# EAGLE design th (EAGLE 6.3)
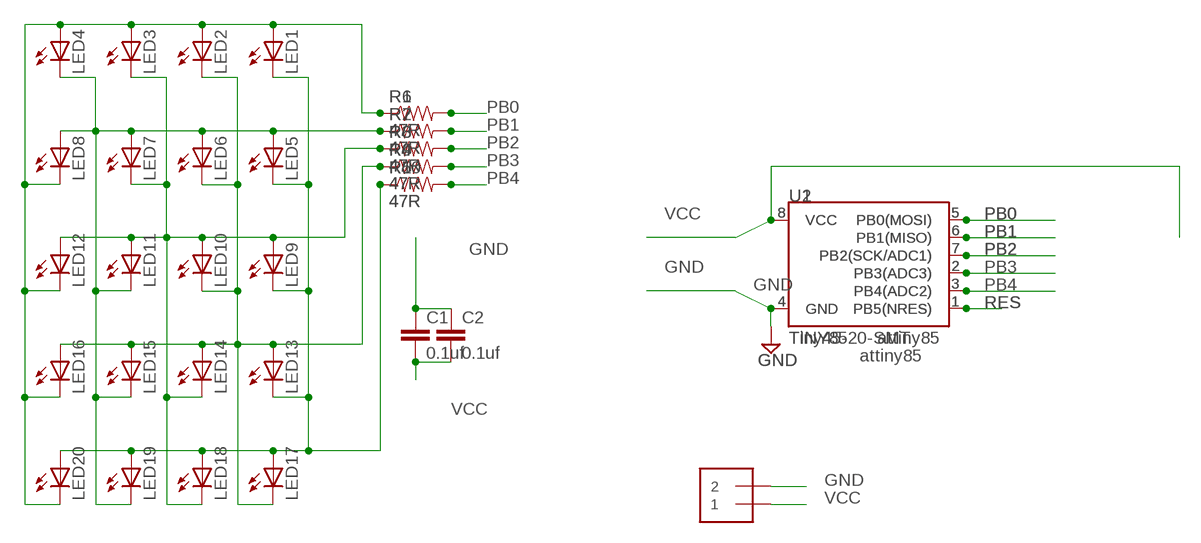
[diagram p0: schematic, sheet 1]

## Parts
C1  0.1uf  CAP0603-CAP  [0603-CAP]
C2  0.1uf  CAPKIT  [CAP-PTH-SMALL-KIT]
J1  1X2-3.5MM  [1X2-3.5MM]
LED1  LED3MM  [LED3MM]
LED2  LED3MM  [LED3MM]
LED3  LED3MM  [LED3MM]
LED4  LED3MM  [LED3MM]
LED5  LED3MM  [LED3MM]
LED6  LED3MM  [LED3MM]
LED7  LED3MM  [LED3MM]
LED8  LED3MM  [LED3MM]
LED9  LED3MM  [LED3MM]
LED10  LED3MM  [LED3MM]
LED11  LED3MM  [LED3MM]
LED12  LED3MM  [LED3MM]
LED13  LED3MM  [LED3MM]
LED14  LED3MM  [LED3MM]
LED15  LED3MM  [LED3MM]
LED16  LED3MM  [LED3MM]
LED17  LED3MM  [LED3MM]
LED18  LED3MM  [LED3MM]
LED19  LED3MM  [LED3MM]
LED20  LED3MM  [LED3MM]
R1  47R  RESISTORAXIAL-0.3  [AXIAL-0.3]
R2  47R  RESISTORAXIAL-0.3  [AXIAL-0.3]
R3  47R  RESISTORAXIAL-0.3  [AXIAL-0.3]
R4  47R  RESISTORAXIAL-0.3  [AXIAL-0.3]
R5  47R  RESISTORAXIAL-0.3  [AXIAL-0.3]
R6  47R  RESISTOR0603-RES  [0603-RES]
R7  47R  RESISTOR0603-RES  [0603-RES]
R8  47R  RESISTOR0603-RES  [0603-RES]
R9  47R  RESISTOR0603-RES  [0603-RES]
R10  47R  RESISTOR0603-RES  [0603-RES]
U1  TINY85  ATTINY45TINY45-20-DIP  [DIP08]
U2  Tiny45-20-SMT  ATTINY45TINY45-20-SMT  [SO08-EIAJ]

## Nets
GND: C1.1 C2.1 J1.2 U1.4(GND) U2.4(GND)
N$6: LED1.A LED2.A LED3.A LED4.A LED8.K(C) LED12.K(C) LED16.K(C) LED20.K(C) R1.P$1 R6.1
N$7: LED4.K(C) LED5.A LED6.A LED7.A LED8.A LED11.K(C) LED15.K(C) LED19.K(C) R2.P$1 R7.1
N$8: LED3.K(C) LED7.K(C) LED9.A LED10.A LED11.A LED12.A LED14.K(C) LED18.K(C) R3.P$1 R8.1
N$9: LED2.K(C) LED6.K(C) LED10.K(C) LED13.A LED14.A LED15.A LED16.A LED17.K(C) R4.P$1 R9.1
N$10: LED1.K(C) LED5.K(C) LED9.K(C) LED13.K(C) LED17.A LED18.A LED19.A LED20.A R5.P$1 R10.1
PB0: R1.P$2 R6.2 U1.5(PB0(MOSI)) U2.5(PB0(MOSI))
PB1: R2.P$2 R7.2 U1.6(PB1(MISO)) U2.6(PB1(MISO))
PB2: R3.P$2 R8.2 U1.7(PB2(SCK/ADC1)) U2.7(PB2(SCK/ADC1))
PB3: R4.P$2 R9.2 U1.2(PB3(ADC3)) U2.2(PB3(ADC3))
PB4: R5.P$2 R10.2 U1.3(PB4(ADC2)) U2.3(PB4(ADC2))
RES: U1.1(PB5(NRES)) U2.1(PB5(NRES))
VCC: C1.2 C2.2 J1.1 U1.8(VCC) U2.8(VCC)

## Notes on the sheet
- attiny85
- attiny85

## Library data of the parts
C1 C2 = SparkFun:CAP: Capacitor Standard 0603 ceramic capacitor, and 0.1" leaded capacitor.
J1 = adafruit:1X2: 3.5mm Terminal block http://www.ladyada.net/library/pcb/eaglelibrary.html
LED1-LED20 = led:LED: LED OSRAM: - CHIPLED LG R971, LG N971, LY N971, LG Q971, LY Q971, LO R971, LY R971 LH N974, LH R974 LS Q976, LO Q976, LY Q976 LO Q996 - Hyper CHIPLED LW Q18S LB Q993, LB Q99A, LB R99A - SideLED LS A670, LO A670, LY A670, LG A670, LP A670 LB A673, LV A673, LT A673, LW A673 LH A674 LY A675 LS A676, LA A676, LO A676, LY A676, LW A676 LS A679, LY A679, LG A679 - Hyper Micro SIDELED® LS Y876, LA Y876, LO Y876, LY Y876 LT Y87S - SmartLED LW L88C, LW L88S LB L89C, LB L89S, LG L890 LS L89K, LO L89K, LY L89K LS L896, LA L896, LO L896, LY L896 - TOPLED LS T670, LO T670, LY T670, LG T670, LP T670 LSG T670, LSP T670, LSY T670, LOP T670, LYG T670 LG T671, LOG T671, LSG T671 LB T673, LV T673, LT T673, LW T673 LH T674 LS T676, LA T676, LO T676, LY T676, LB T676, LH T676, LSB T676, LW T676 LB T67C, LV T67C, LT T67C, LS T67K, LO T67K, LY T67K, LW E67C LS E67B, LA E67B, LO E67B, LY E67B, LB E67C, LV E67C, LT E67C LW T67C LS T679, LY T679, LG T679 LS T770, LO T770, LY T770, LG T770, LP T770 LB T773, LV T773, LT T773, LW T773 LH T774 LS E675, LA E675, LY E675, LS T675 LS T776, LA T776, LO T776, LY T776, LB T776 LHGB T686 LT T68C, LB T68C - Hyper Mini TOPLED® LB M676 - Mini TOPLED Santana® LG M470 LS M47K, LO M47K, LY M47K Source: http://www.osram.convergy.de LUXEON: - LUMILED® LXK2-PW12-R00, LXK2-PW12-S00, LXK2-PW14-U00, LXK2-PW14-V00 LXK2-PM12-R00, LXK2-PM12-S00, LXK2-PM14-U00 LXK2-PE12-Q00, LXK2-PE12-R00, LXK2-PE12-S00, LXK2-PE14-T00, LXK2-PE14-U00 LXK2-PB12-K00, LXK2-PB12-L00, LXK2-PB12-M00, LXK2-PB14-N00, LXK2-PB14-P00, LXK2-PB14-Q00 LXK2-PR12-L00, LXK2-PR12-M00, LXK2-PR14-Q00, LXK2-PR14-R00 LXK2-PD12-Q00, LXK2-PD12-R00, LXK2-PD12-S00 LXK2-PH12-R00, LXK2-PH12-S00 LXK2-PL12-P00, LXK2-PL12-Q00, LXK2-PL12-R00 Source: www.luxeon.com KINGBRIGHT: KA-3528ASYC Source: www.kingbright.com
R1-R10 = SparkFun:RESISTOR: Resistor Basic schematic elements and footprints for 0603, 1206, and PTH resistors.
U1 = SparkFun-DigitalIC:ATTINY45: Atmel 8-pin 2/4/8kB flash uC; PROD_ID: IC-09439; VALUE: TINY45-20-DIP
U2 = SparkFun-DigitalIC:ATTINY45: Atmel 8-pin 2/4/8kB flash uC; PROD_ID: IC-08922

## Net classes
0 default: width 0.381 mm, drill 0.381 mm, clearance 0.381 mm
1 GND: width 0.381 mm, drill 0.381 mm, clearance 0.381 mm

## Board
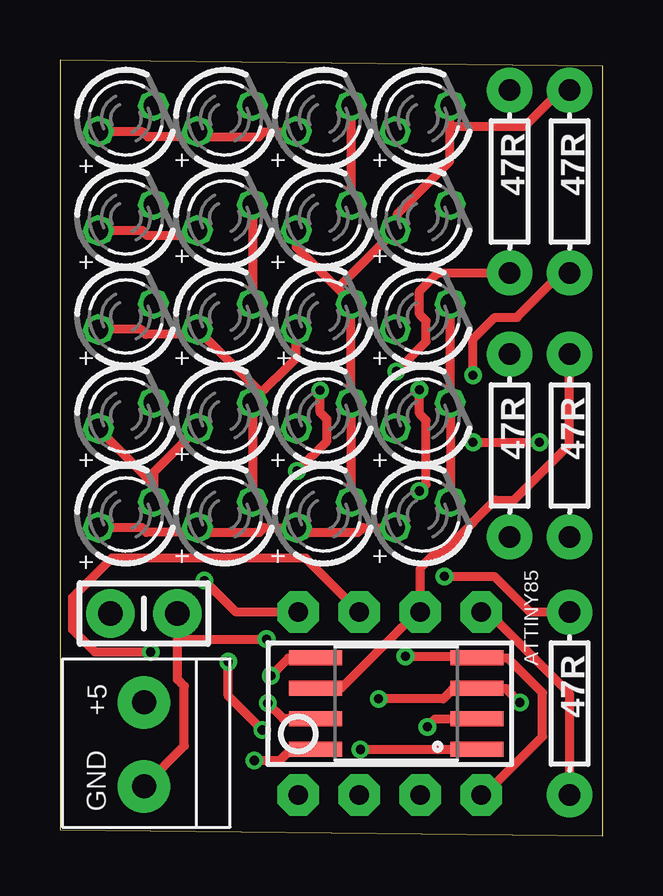
[diagram p1: board, top side]
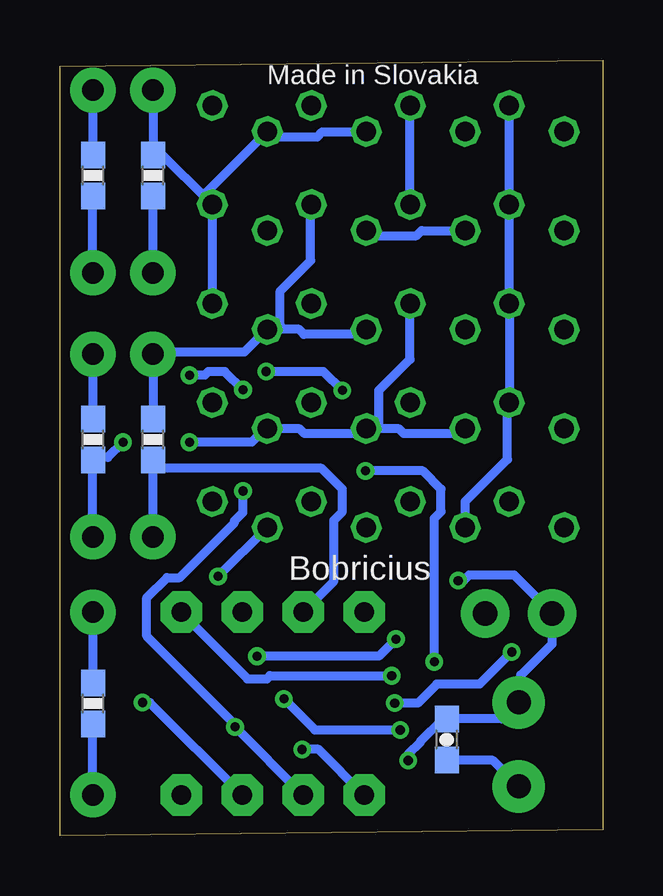
[diagram p2: board, bottom side, seen from below]

Size 22.62 x 32.31 mm. Coordinates in mm from the lower left corner, seen from the top.
Outline: 0,32.31 0,0.25 22.62,0 22.62,32.06 0,32.31
Copper layers (1*16): Top 0.0356mm / dielectric 1.5011mm / Bottom 0.0356mm
Design rules "default *": minimum track width 8mil, minimum drill 13mil, track to track 8mil, track to pad 8mil, pad to pad 8mil, via to via 8mil, smd to smd 8mil, copper to edge 15mil, drill to drill 12mil, minimum pad ring 7mil, minimum via ring 7mil, stop-mask expansion 4mil, vias tented up to drill 20mil, thermal gap 10mil

### Footprints (pad centres in the part's own frame; a part is rotated, then mirrored left to right if it is on the bottom)
0603-CAP = smd 1.1 x 1: 1 -0.85,0; 2 0.85,0
CAP-PTH-SMALL-KIT = drill 1.016 pad 2.032: 1 -1.397,0; 2 1.397,0
1X2-3.5MM = drill 1 pad 2.184: 1 1.8,0; 2 -1.7,0
LED3MM = drill 0.813 octagon: A -1.27,0; K 1.27,0
AXIAL-0.3 = drill 0.9 pad 1.88: P$1 -3.81,0; P$2 3.81,0
0603-RES = smd 1.1 x 1: 1 -0.85,0; 2 0.85,0
DIP08 = drill 0.813 pad 1.727 octagon: 1 -3.81,-3.81; 2 -1.27,-3.81; 3 1.27,-3.81; 4 3.81,-3.81; 5 3.81,3.81; 6 1.27,3.81; 7 -1.27,3.81; 8 -3.81,3.81
SO08-EIAJ = smd 0.61 x 2.21: 1 -1.905,-3.378; 2 -0.635,-3.378; 3 0.635,-3.378; 4 1.905,-3.378; 5 1.905,3.353; 6 0.635,3.353; 7 -0.635,3.353; 8 -1.905,3.353

### Placement (x,y rotation side)
C1  6.5,4 90 bottom
C2  3.5,9.25 180 top
J1  3.5,3.75 90 top
LED1  15.12,13.38 25 top
LED2  11,13.38 25 top
LED3  6.88,13.38 25 top
LED4  2.75,13.38 25 top
LED5  15.12,17.5 25 top
LED6  11,17.5 25 top
LED7  6.88,17.5 25 top
LED8  2.75,17.5 25 top
LED9  15.12,21.62 25 top
LED10  11,21.62 25 top
LED11  6.88,21.62 25 top
LED12  2.75,21.62 25 top
LED13  15.12,25.75 25 top
LED14  11,25.75 25 top
LED15  6.88,25.75 25 top
LED16  2.75,25.75 25 top
LED17  15.12,29.88 25 top
LED18  11,29.88 25 top
LED19  6.88,29.88 25 top
LED20  2.75,29.88 25 top
R1  21.25,5.5 270 top
R2  21.25,16.25 90 top
R3  18.75,16.25 270 top
R4  21.25,27.25 270 top
R5  18.75,27.25 270 top
R6  21.25,5.5 270 bottom
R7  21.25,16.5 90 bottom
R8  18.75,16.5 270 bottom
R9  21.25,27.5 270 bottom
R10  18.75,27.5 270 bottom
U1  13.75,5.5 0 top
U2  14,5.5 90 top

### Tracks (layer width: path | path; a pad name or v marks a point on that pad's centre or on a via)
GND  (via drill 0.38)
  Top 0.381: U1.4 17.58,1.7 17.71,1.7 20.12,4.12 20.12,5.95 18.67,7.39 17.4,7.39 U2.4 17.2,7.47 v14.41,7.47 | 4.91,8.18 4.91,6.51 5.19,6.23 5.19,3.74 J1.2 | 4.91,8.18 C2.1 | 4.91,8.18 v8.61,8.18
  Bottom 0.381: C1.1 6.48,3.13 4.58,3.13 J1.2 | v14.41,7.47 9.33,7.47 v8.61,8.18
N$6  (via drill 0.38)
  Top 0.381: LED4.A 3.41,12.83 3.61,12.63 5.52,12.63 LED3.A 5.77,12.63 8.31,12.63 8.51,12.83 9.83,12.83 LED2.A 10.01,12.73 10.11,12.63 12.42,12.63 12.63,12.83 LED1.A | v16.03,10.8 18.11,10.8 19.59,9.32 21.24,9.32 R1.P$1
  Bottom 0.381: LED20.K 3.89,26.47 LED16.K 3.89,26.27 3.89,22.33 LED12.K LED8.K 3.97,17.86 3.97,15.67 5.72,13.92 5.72,12.86 LED3.A | R6.1 21.26,6.35 21.26,9.3 R1.P$1 | v16.03,10.8 14,12.83 LED1.A
N$7  (via drill 0.38)
  Top 0.381: LED11.K 8.03,22.18 8.03,26.27 LED15.K | 3.91,14.81 3.91,15.14 5.72,16.95 LED7.A | 3.91,14.81 3.91,13.92 LED4.K | LED8.A 1.6,16.95 3.74,14.81 3.91,14.81 | v17.23,16.39 v19.99,16.39
  Bottom 0.381: LED19.K LED15.K | R2.P$1 21.26,12.45 21.26,15.65 R7.1 21.09,15.75 20.63,15.75 v19.99,16.39 | LED6.A 9.83,16.95 8.49,16.95 8.28,16.74 5.95,16.74 5.74,16.95 LED7.A | LED6.A 10.04,16.89 10.19,16.74 12.42,16.74 12.63,16.95 13.97,16.95 LED5.A 14.15,16.87 14.63,16.39 v17.23,16.39 | LED11.K 8.03,19.84 9.33,18.55 9.33,17.12 LED6.A
N$8
  Top 0.381: LED14.K LED18.K | LED12.A 3.38,21.09 3.59,20.88 5.52,20.88 LED11.A 5.87,20.96 8.26,18.57 LED7.K | LED3.K 8.03,13.92 8.03,18.01 LED7.K | LED10.A 9.83,21.09 9.83,19.89 8.13,18.19 LED7.K
  Bottom 0.381: R8.1 18.75,20.04 R3.P$1 18.57,20.15 14.94,20.15 14.13,20.96 LED9.A | LED9.A 12.65,21.09 12.45,20.88 10.06,20.88 LED10.A | LED14.K 12.17,26.27 12.17,23.95 13.44,22.69 13.44,21.26 LED9.A
N$9
  Top 0.381: LED16.A 3.43,25.2 3.64,25 5.52,25 LED15.A | LED2.K 12.14,13.92 12.14,18.01 LED6.K 12.14,18.22 LED10.K 12.04,22.33 11.57,22.8 | 11.57,22.8 9.86,24.51 LED14.A | 11.57,22.8 LED13.A 14.07,25.38 14.07,25.91 16.26,28.1 16.26,29.54 | 16.26,29.54 16.26,30.41 LED17.K | 16.26,29.54 19.38,29.54 20.88,31.04 21.24,31.04 R4.P$1
  Bottom 0.381: R9.1 21.26,28.38 21.26,31.04 R4.P$1 | LED15.A 5.74,25.2 7.55,25.2 7.75,25 9.63,25 9.83,25.2 LED14.A
N$10
  Top 0.381: LED20.A 1.6,29.31 3.46,29.31 3.66,29.11 5.52,29.11 5.72,29.31 LED19.A 5.77,29.11 8.28,29.11 8.49,29.31 9.83,29.31 LED18.A | LED1.K 16.29,13.92 16.29,18.01 LED5.K 16.29,18.24 LED9.K
  Bottom 0.381: R5.P$1 18.75,31.04 18.75,28.38 R10.1 18.57,28.58 LED13.K | LED13.K 16.54,26.77 14,29.31 LED17.A 13.95,29.11 11.89,29.11 11.69,29.31 9.86,29.31 LED18.A | LED9.K 16.29,22.18 16.29,26.09 LED13.K
PB0  (via drill 0.38)
  Top 0.381: v8.79,6.66 9.53,7.39 10.65,7.39 U2.5 | R1.P$2 21.24,1.7 21.24,5.92 17.86,9.3 17.58,9.3 U1.5
  Bottom 0.381: R6.2 21.26,4.63 21.26,1.7 R1.P$2 | v8.79,6.66 13.87,6.66 14,6.53 14.81,6.53 17.58,9.3 U1.5
PB1
  Top 0.381: U2.6 10.67,6.15 11.74,6.15 14.89,9.3 U1.6 15.04,9.5 15.04,11.15 15.62,11.74 15.93,11.74 17.23,13.03 17.23,13.06 18.14,13.97 18.93,13.97 21.24,16.28 21.24,20.04 R2.P$2
  Bottom 0.381: R7.2 21.26,17.35 21.26,20.04 R2.P$2
PB2  (via drill 0.38)
  Top 0.381: v8.66,5.52 9.3,4.88 10.65,4.88 U2.7 | v3.79,7.65 1.45,7.65 0.51,8.59 0.51,9.91 2.16,11.56 10.24,11.56 12.48,9.32 U1.7
  Bottom 0.381: R3.P$2 R8.2 18.57,15.29 11.71,15.29 10.85,14.43 10.85,13.49 11.2,13.13 11.2,10.59 12.48,9.32 U1.7 | v8.66,5.52 7.7,5.52 6.91,6.3 5.13,6.3 v3.79,7.65
PB3  (via drill 0.38)
  Top 0.381: v15.32,4.52 15.65,4.86 U2.2 | v17.23,19.18 17.23,20.68 18.14,21.59 19.05,21.59 20.88,23.42 21.24,23.42 R4.P$2 | v14.99,18.57 14.99,17.58 15.27,17.3 15.27,14.63 v14.99,14.35
  Bottom 0.381: R9.2 21.26,26.65 21.26,23.45 R4.P$2 | U1.2 12.5,1.7 v15.32,4.52 15.4,4.7 19,8.31 19,9.91 18.16,10.75 17.63,10.75 15.34,13.03 15.34,13.11 14.99,13.47 v14.99,14.35 | v17.23,19.18 16.59,19.18 16.44,19.33 15.75,19.33 v14.99,18.57
PB4  (via drill 0.38)
  Top 0.381: v19.18,5.54 18.6,6.12 17.4,6.12 U2.3 17.2,6.07 16.36,6.07 15.98,5.69 v13.29,5.69 | v14.02,19.33 15.27,20.58 15.27,21.44 14.99,21.72 14.99,22.69 15.75,23.45 R5.P$2 | v10.85,18.55 10.85,17.63 11.13,17.35 11.13,16.44 v9.88,15.19 | v7.01,7.24 7.01,5.82 v8.44,4.4
  Bottom 0.381: R10.2 R5.P$2 | v19.18,5.54 18.88,5.54 15.04,1.7 U1.3 | v14.02,19.33 11.64,19.33 v10.85,18.55 | v9.88,15.19 7.5,15.19 6.73,14.43 6.73,13.49 7.01,13.21 v7.01,7.24 | v8.44,4.4 11.99,4.4 v13.29,5.69
RES  (via drill 0.38)
  Top 0.381: v12.53,3.59 U2.1
  Bottom 0.381: v12.53,3.59 11.84,3.59 9.96,1.7 U1.1
VCC  (via drill 0.38)
  Top 0.381: v8.11,3.13 9.17,3.13 9.63,3.59 U2.8 | v6.02,10.62 7.32,9.32 9.94,9.32 U1.8
  Bottom 0.381: v8.11,3.13 8.11,3.38 7.57,3.91 7.57,3.94 6.68,4.83 C1.2 6.48,4.86 4.2,4.86 J1.1 3.41,5.72 3.41,6.68 2.11,7.98 2.11,9.05 C2.2 2.11,9.27 3.69,10.85 5.57,10.85 5.79,10.62 v6.02,10.62

### Text on the board
tPlace: + | + | + | + | + | + | + | + | + | + | + | + | + | + | + | + | + | + | + | +
tNames: ATTINY85 | +5 | GND
bNames: Made in Slovakia | Bobricius